# EAGLE schematic Touch_V5 (EAGLE 6.1)
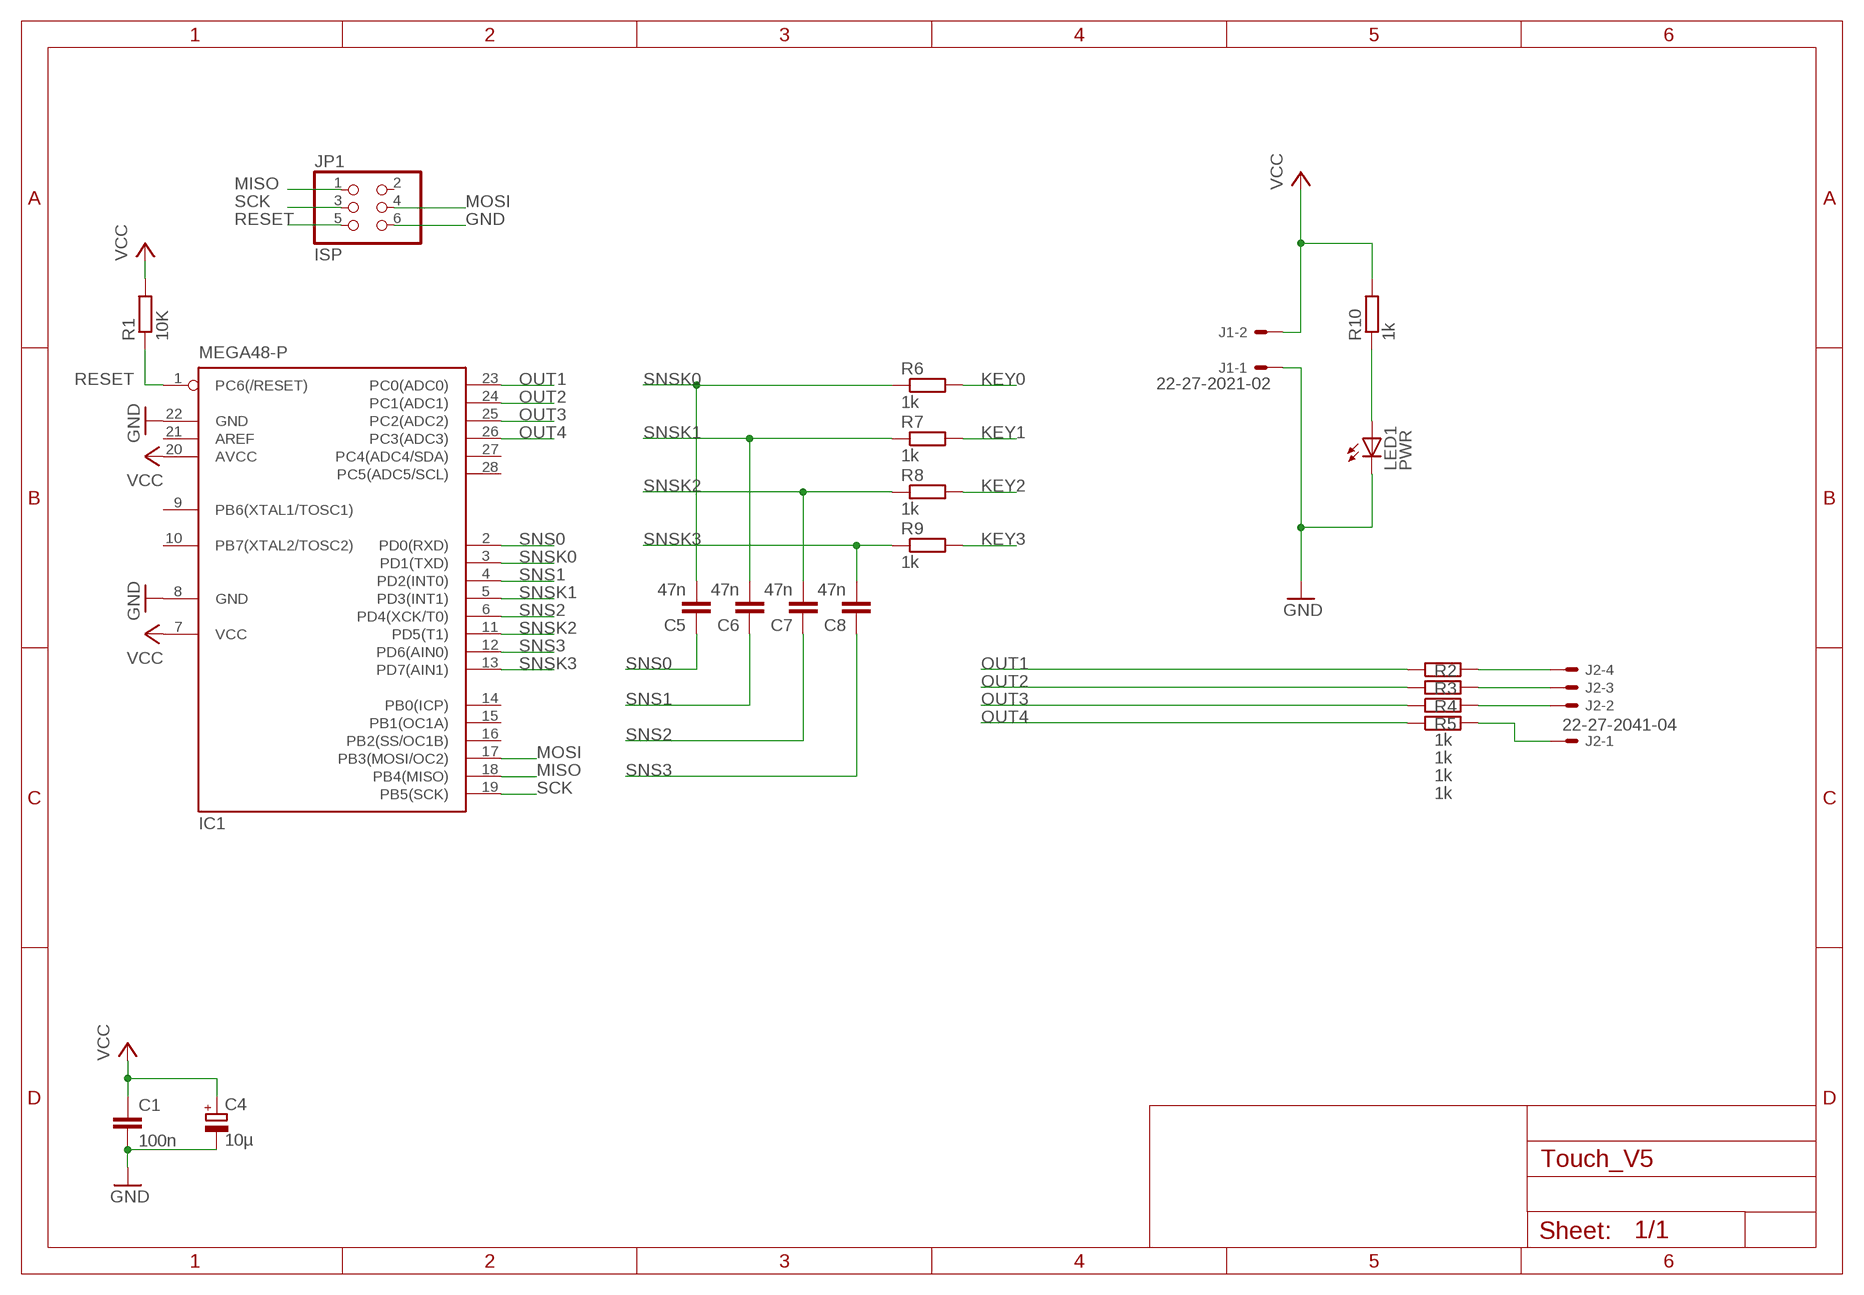
[diagram p0: schematic, sheet 1]

## Parts
C1  100n  C-EU050-025X075  [C050-025X075]
C4  10µ  CPOL-EUE2-5  [E2-5]
C5  47n  C-EU050-025X075  [C050-025X075]
C6  47n  C-EU050-025X075  [C050-025X075]
C7  47n  C-EU050-025X075  [C050-025X075]
C8  47n  C-EU050-025X075  [C050-025X075]
IC1  MEGA48-P  MEGA8-P  [DIL28-3]
J1  22-27-2021-02  [6410-02]
J2  22-27-2041-04  [6410-04]
JP1  ISP  PINHD-2X3  [2X03]
LED1  PWR  LED3MM  [LED3MM]
R1  10K  R-EU_0207/10  [0207/10]
R2  1k  R-EU_0207/10  [0207/10]
R3  1k  R-EU_0207/10  [0207/10]
R4  1k  R-EU_0207/10  [0207/10]
R5  1k  R-EU_0207/10  [0207/10]
R6  1k  R-EU_0207/10  [0207/10]
R7  1k  R-EU_0207/10  [0207/10]
R8  1k  R-EU_0207/10  [0207/10]
R9  1k  R-EU_0207/10  [0207/10]
R10  1k  R-EU_0207/10  [0207/10]

## Nets
GND: C1.2 C4.- IC1.8(GND) IC1.22(GND) J1.1 JP1.6 LED1.K(C)
KEY0: R6.2
KEY1: R7.2
KEY2: R8.2
KEY3: R9.2
MISO: IC1.18(PB4(MISO)) JP1.1
MOSI: IC1.17(PB3(MOSI/OC2)) JP1.4
N$2: J2.4 R2.2
N$3: J2.3 R3.2
N$4: J2.2 R4.2
N$5: J2.1 R5.2
N$6: LED1.A R10.1
OUT1: IC1.23(PC0(ADC0)) R2.1
OUT2: IC1.24(PC1(ADC1)) R3.1
OUT3: IC1.25(PC2(ADC2)) R4.1
OUT4: IC1.26(PC3(ADC3)) R5.1
RESET: IC1.1(PC6(/RESET)) JP1.5 R1.1
SCK: IC1.19(PB5(SCK)) JP1.3
SNS0: C5.1 IC1.2(PD0(RXD))
SNS1: C6.1 IC1.4(PD2(INT0))
SNS2: C7.1 IC1.6(PD4(XCK/T0))
SNS3: C8.1 IC1.12(PD6(AIN0))
SNSK0: C5.2 IC1.3(PD1(TXD)) R6.1
SNSK1: C6.2 IC1.5(PD3(INT1)) R7.1
SNSK2: C7.2 IC1.11(PD5(T1)) R8.1
SNSK3: C8.2 IC1.13(PD7(AIN1)) R9.1
VCC: C1.1 C4.+ IC1.7(VCC) IC1.20(AVCC) J1.2 R1.2 R10.2
Unconnected: IC1.9(PB6(XTAL1/TOSC1)) IC1.10(PB7(XTAL2/TOSC2)) IC1.14(PB0(ICP)) IC1.15(PB1(OC1A)) IC1.16(PB2(SS/OC1B)) IC1.21(AREF) IC1.27(PC4(ADC4/SDA)) IC1.28(PC5(ADC5/SCL)) JP1.2

## Library data of the parts
C1 C5-C8 = rcl:C-EU: CAPACITOR, European symbol
C4 = rcl:CPOL-EU: POLARIZED CAPACITOR, European symbol
IC1 = atmel:MEGA8-P: MICROCONTROLLER 8 Kbytes FLASH, 1 kbytes SRAM, 512 bytes EEPROM, USART, 4-channel 10 bit ADC, 2-channel 8 bit ADC Pin compatible with Atmega48, ATMega88, ATMega168 Source: avr.lbr
J1 = con-molex:22-?-02: CONNECTOR wire to board 2.54 mm (.1 inch) pitch header
J2 = con-molex:22-?-04: CONNECTOR wire to board 2.54 mm (.1 inch) pitch header
JP1 = pinhead:PINHD-2X3: PIN HEADER
LED1 = led:LED: LED OSRAM: - CHIPLED LG R971, LG N971, LY N971, LG Q971, LY Q971, LO R971, LY R971 LH N974, LH R974 LS Q976, LO Q976, LY Q976 LO Q996 - Hyper CHIPLED LW Q18S LB Q993, LB Q99A, LB R99A - SideLED LS A670, LO A670, LY A670, LG A670, LP A670 LB A673, LV A673, LT A673, LW A673 LH A674 LY A675 LS A676, LA A676, LO A676, LY A676, LW A676 LS A679, LY A679, LG A679 - Hyper Micro SIDELED® LS Y876, LA Y876, LO Y876, LY Y876 LT Y87S - SmartLED LW L88C, LW L88S LB L89C, LB L89S, LG L890 LS L89K, LO L89K, LY L89K LS L896, LA L896, LO L896, LY L896 - TOPLED LS T670, LO T670, LY T670, LG T670, LP T670 LSG T670, LSP T670, LSY T670, LOP T670, LYG T670 LG T671, LOG T671, LSG T671 LB T673, LV T673, LT T673, LW T673 LH T674 LS T676, LA T676, LO T676, LY T676, LB T676, LH T676, LSB T676, LW T676 LB T67C, LV T67C, LT T67C, LS T67K, LO T67K, LY T67K, LW E67C LS E67B, LA E67B, LO E67B, LY E67B, LB E67C, LV E67C, LT E67C LW T67C LS T679, LY T679, LG T679 LS T770, LO T770, LY T770, LG T770, LP T770 LB T773, LV T773, LT T773, LW T773 LH T774 LS E675, LA E675, LY E675, LS T675 LS T776, LA T776, LO T776, LY T776, LB T776 LHGB T686 LT T68C, LB T68C - Hyper Mini TOPLED® LB M676 - Mini TOPLED Santana® LG M470 LS M47K, LO M47K, LY M47K Source: http://www.osram.convergy.de LUXEON: - LUMILED® LXK2-PW12-R00, LXK2-PW12-S00, LXK2-PW14-U00, LXK2-PW14-V00 LXK2-PM12-R00, LXK2-PM12-S00, LXK2-PM14-U00 LXK2-PE12-Q00, LXK2-PE12-R00, LXK2-PE12-S00, LXK2-PE14-T00, LXK2-PE14-U00 LXK2-PB12-K00, LXK2-PB12-L00, LXK2-PB12-M00, LXK2-PB14-N00, LXK2-PB14-P00, LXK2-PB14-Q00 LXK2-PR12-L00, LXK2-PR12-M00, LXK2-PR14-Q00, LXK2-PR14-R00 LXK2-PD12-Q00, LXK2-PD12-R00, LXK2-PD12-S00 LXK2-PH12-R00, LXK2-PH12-S00 LXK2-PL12-P00, LXK2-PL12-Q00, LXK2-PL12-R00 Source: www.luxeon.com KINGBRIGHT: KA-3528ASYC Source: www.kingbright.com
R1-R10 = rcl:R-EU_: RESISTOR, European symbol